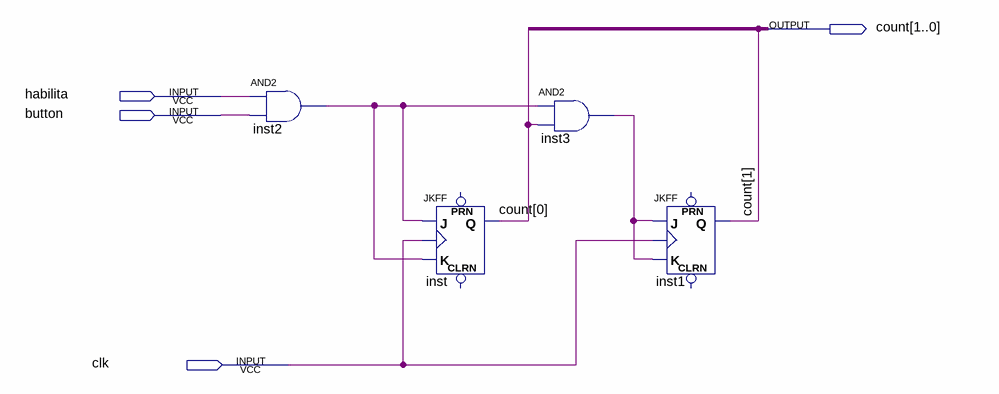
[diagram p0: schematic sheet]
// Quartus schematic contador.bdf as structural Verilog: 4 symbols, 4 pins
module contador (
  input  habilita,
  input  button,
  input  clk,
  output [1:0] count
);

  wire inst2_out, inst3_out;

  and inst2 (inst2_out, habilita, button);
  JKFF inst (.K(inst2_out), .J(inst2_out), .CLK(clk), .Q(count[0]));  // open: PRN, CLRN
  and inst3 (inst3_out, inst2_out, count[0]);
  JKFF inst1 (.K(inst3_out), .J(inst3_out), .CLK(clk), .Q(count[1]));  // open: PRN, CLRN
endmodule
